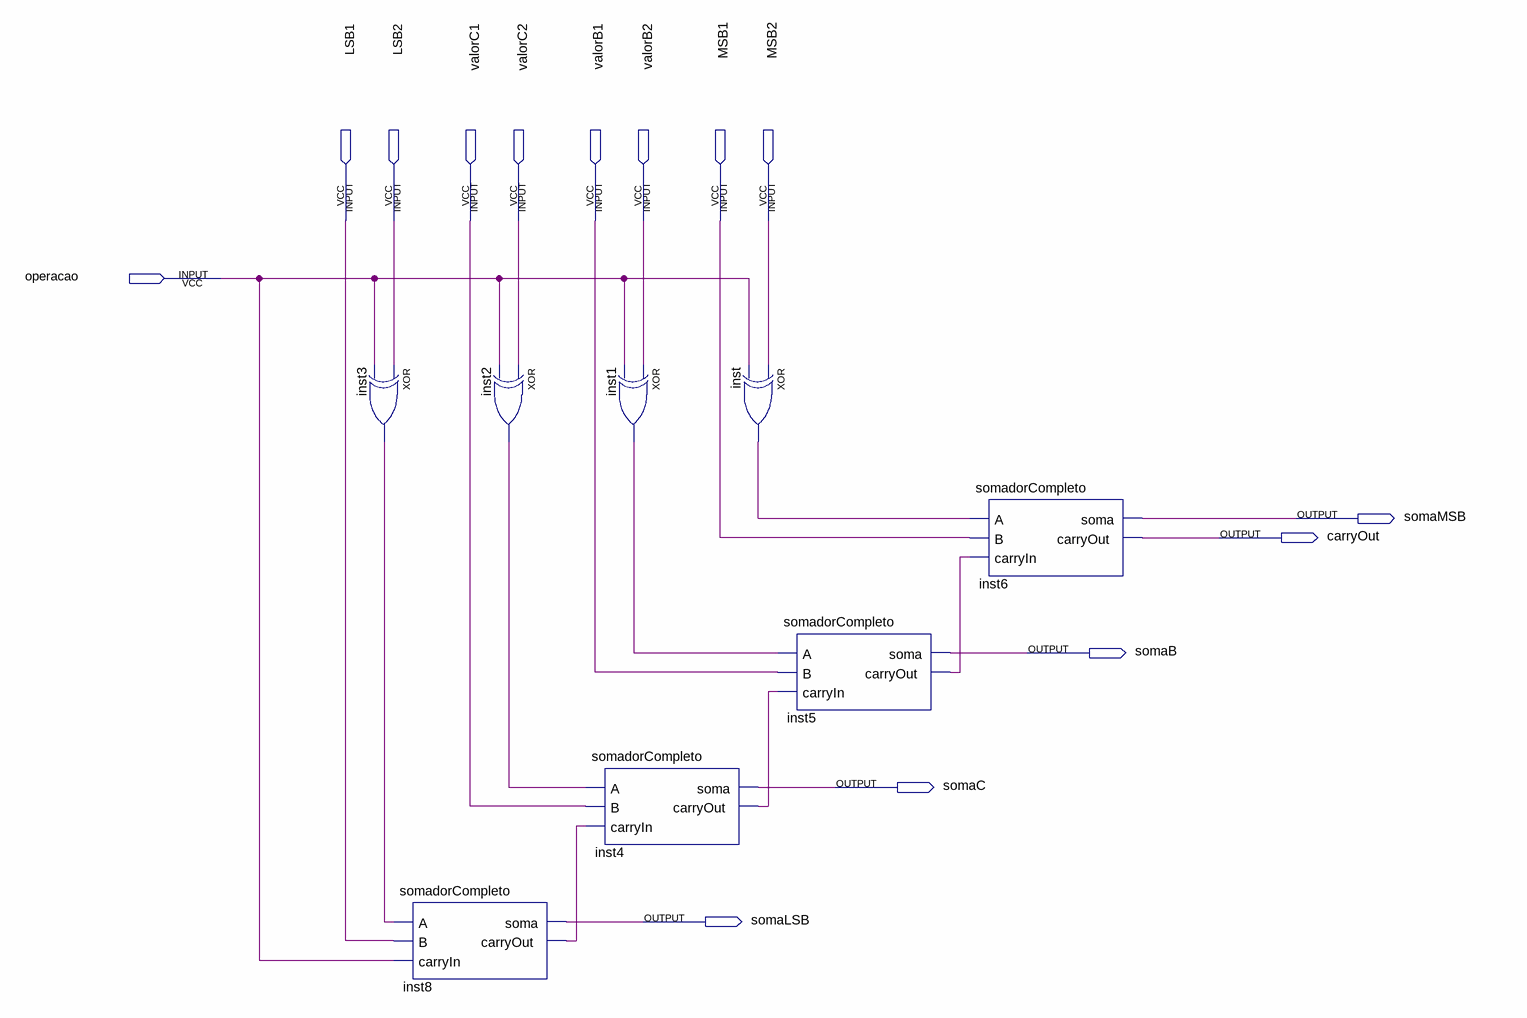
[diagram p0: schematic sheet]
// Quartus schematic somadorSubtrator.bdf as structural Verilog: 8 symbols, 14 pins
module somadorSubtrator (
  input  LSB1,
  input  LSB2,
  input  valorC1,
  input  valorC2,
  input  valorB1,
  input  valorB2,
  input  MSB1,
  input  MSB2,
  input  operacao,
  output somaMSB,
  output carryOut,
  output somaB,
  output somaC,
  output somaLSB
);

  wire inst1_out, inst2_out, inst3_out, inst4_carryout, inst5_carryout, inst8_carryout, inst_out;

  xor inst3 (inst3_out, LSB2, operacao);
  somadorCompleto inst8 (.A(inst3_out), .B(LSB1), .carryIn(operacao), .soma(somaLSB), .carryOut(inst8_carryout));
  xor inst2 (inst2_out, valorC2, operacao);
  xor inst1 (inst1_out, valorB2, operacao);
  somadorCompleto inst4 (.A(inst2_out), .B(valorC1), .carryIn(inst8_carryout), .soma(somaC), .carryOut(inst4_carryout));
  xor inst (inst_out, MSB2, operacao);
  somadorCompleto inst5 (.A(inst1_out), .B(valorB1), .carryIn(inst4_carryout), .soma(somaB), .carryOut(inst5_carryout));
  somadorCompleto inst6 (.A(inst_out), .B(MSB1), .carryIn(inst5_carryout), .soma(somaMSB), .carryOut(carryOut));
endmodule
